# EAGLE board Vorlage ATmega2560-16AU (EAGLE 9.6.2), part 1 of 2
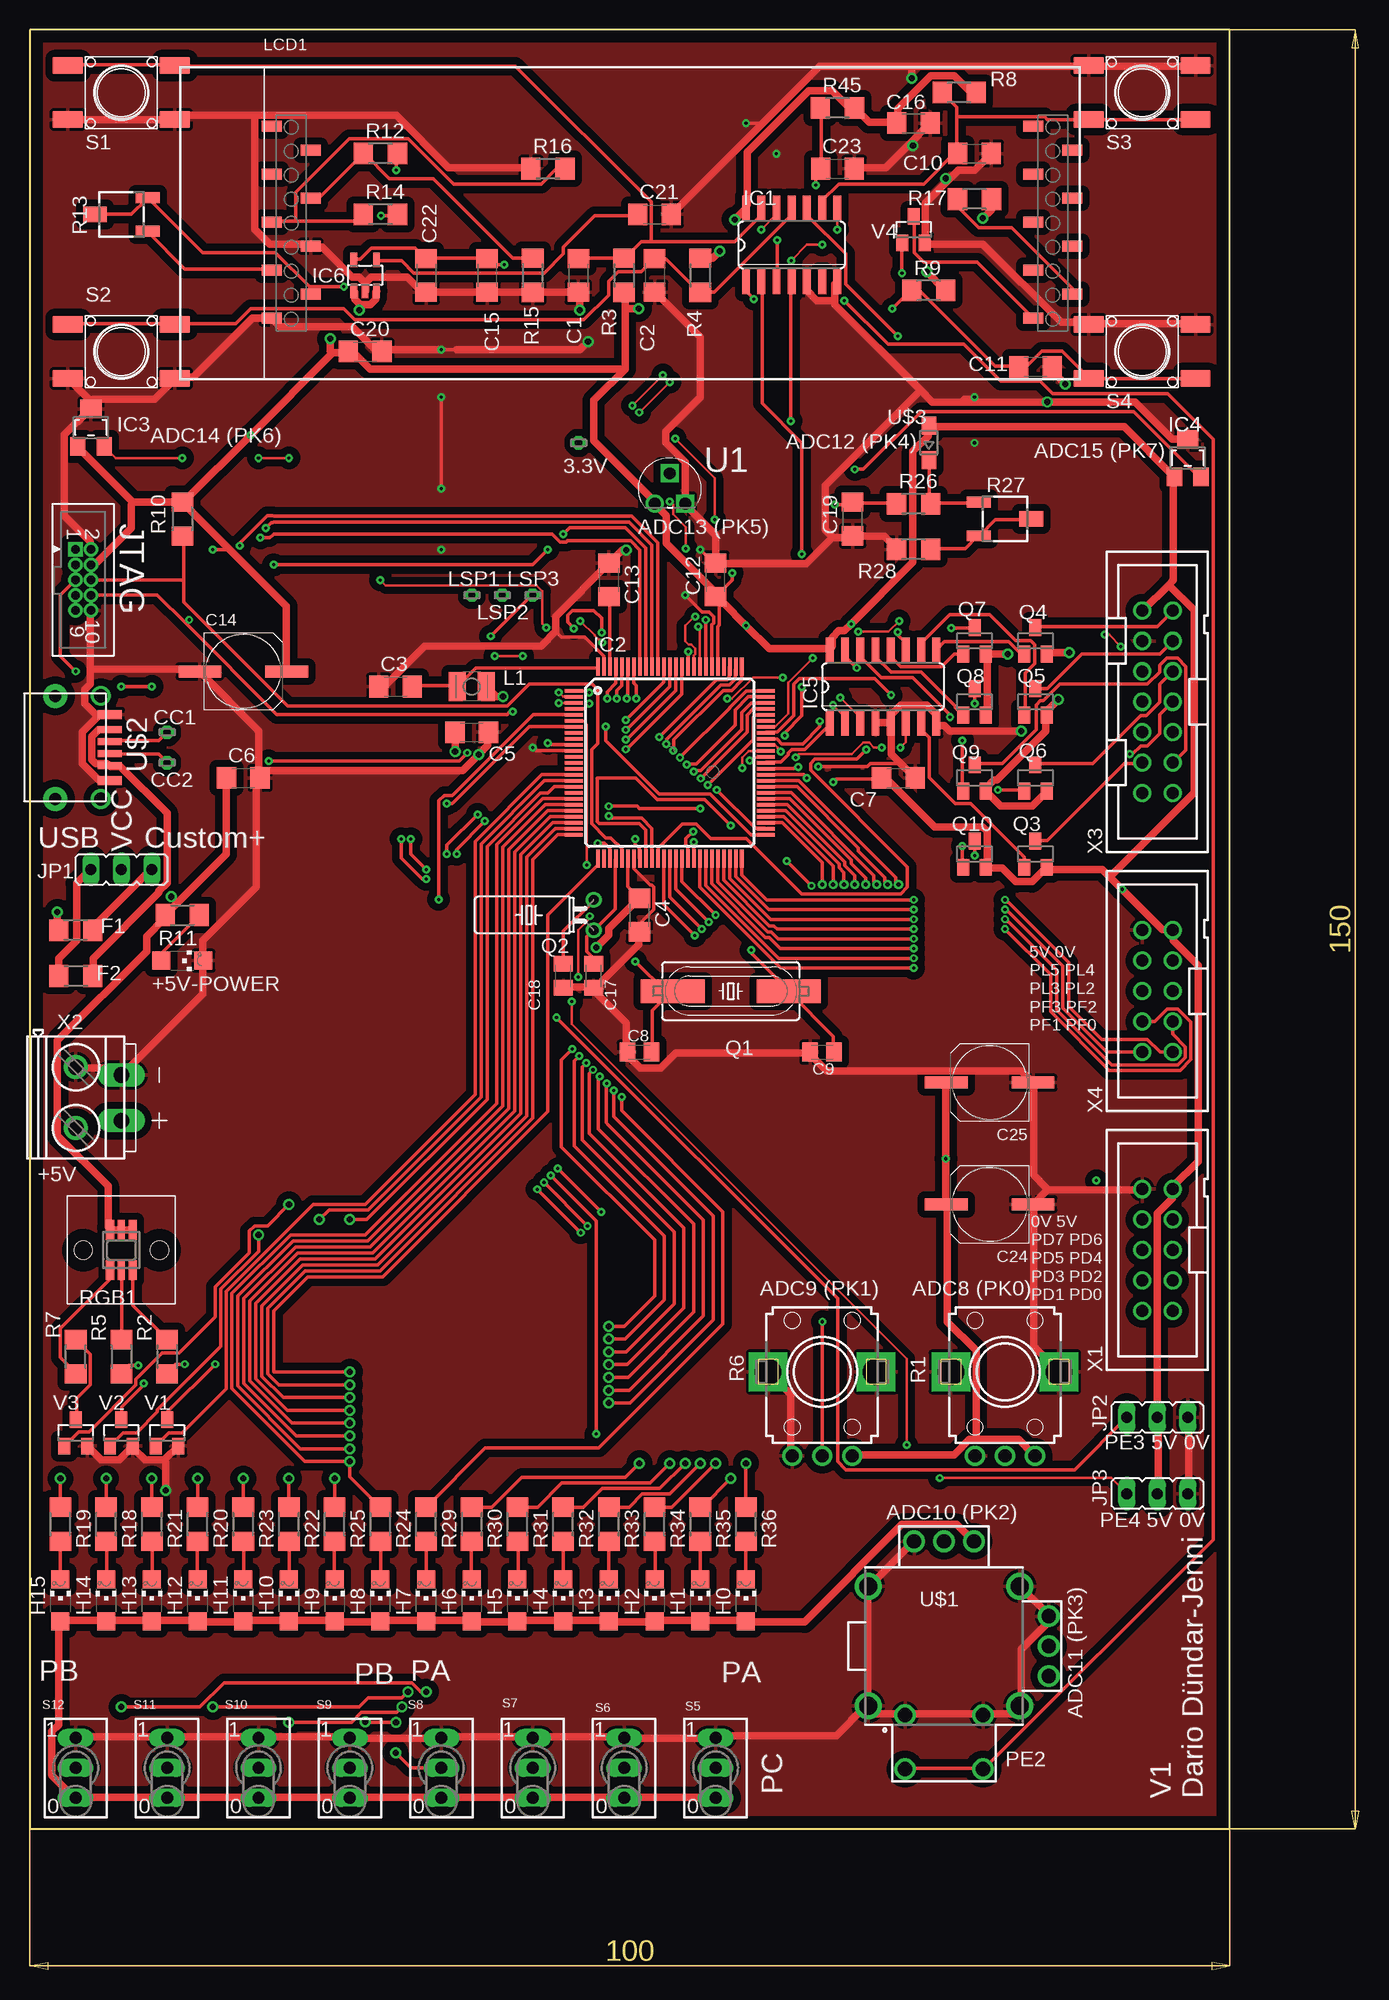
[diagram p1: board, top side]
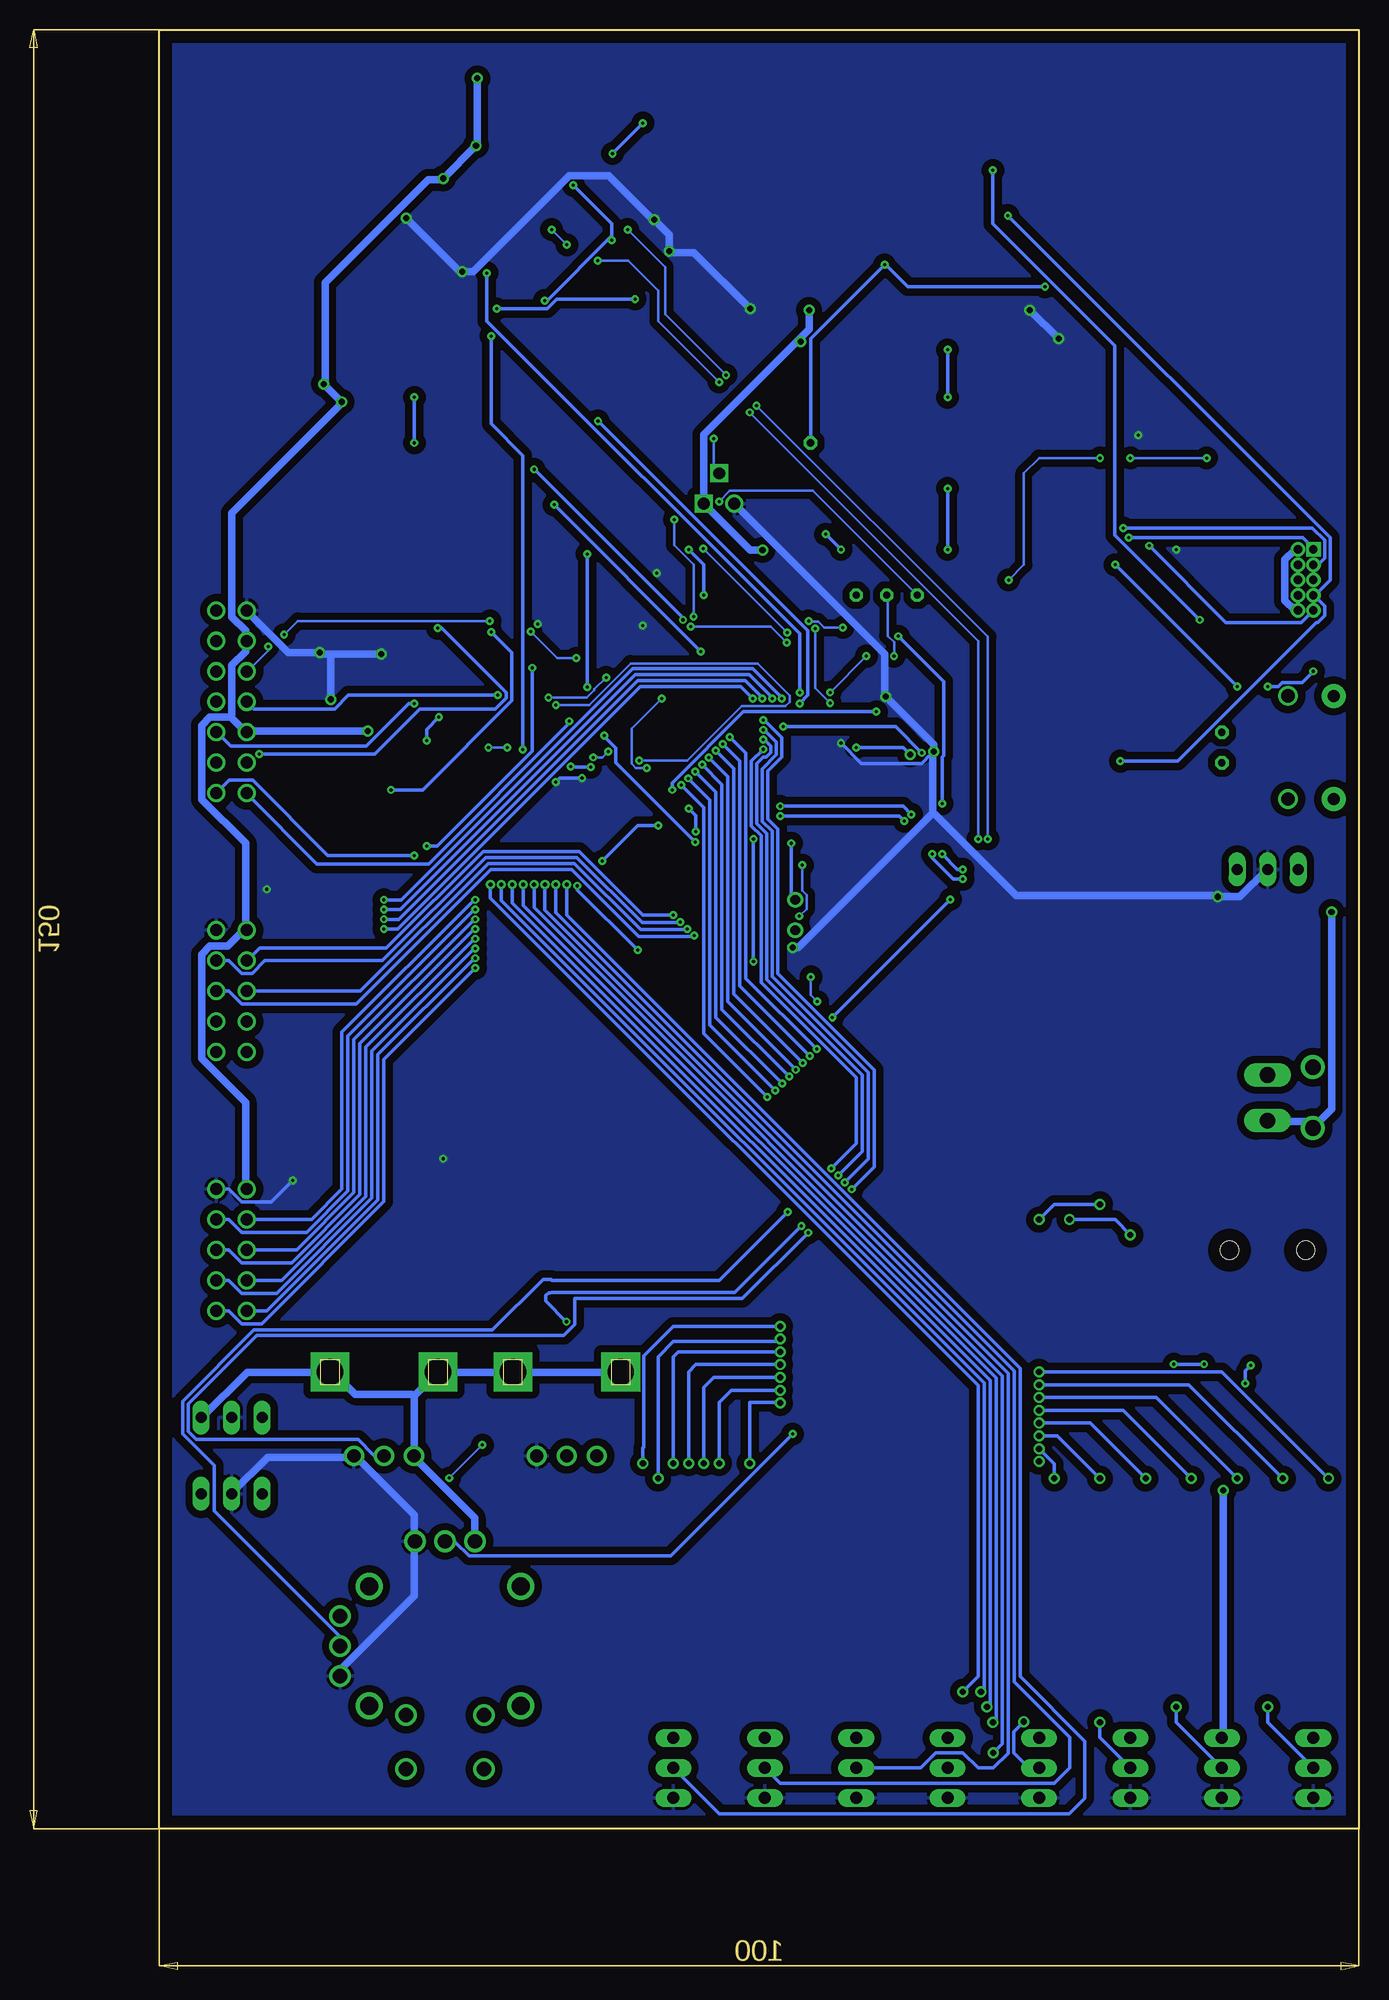
[diagram p2: board, bottom side, seen from below]

Size 100 x 150 mm. Coordinates in mm from the lower left corner, seen from the top.
Outline: 0,0 100,0 100,150 0,150 0,0
Copper layers (1*16): Top 0.035mm / dielectric 1.5mm / Bottom 0.035mm
Design rules "default *": minimum track width 6mil, minimum drill 10mil, track to track 6mil, track to pad 6mil, pad to pad 6mil, via to via 6mil, smd to smd 6mil, copper to edge 40mil, drill to drill 6mil, minimum pad ring 10mil, minimum via ring 8mil, stop-mask expansion 4mil, vias tented up to drill 0mil, thermal gap 10mil
Net classes: 0 default: width 0.203 mm, drill 0.152 mm; 1 POWER: width 0.305 mm, drill 0.254 mm

## Footprints (pad centres in the part's own frame; a part is rotated, then mirrored left to right if it is on the bottom)
LSP11 = drill 0.6 pad 1.016 octagon: MP 0,0
CHIPLED_1206 = smd 1.5 x 1.5: A 0,-1.75; C 0,1.75
C1206 = smd 1.6 x 1.8: 1 -1.4,0; 2 1.4,0
C0805K = smd 1.3 x 1.6: 1 -1,0; 2 1,0
UD-6,3X5,8_NICHICON = smd 3.556 x 1: + 3.62,0; - -3.62,0
F1206 = smd 1.6 x 1.803: 1 -1.422,0; 2 1.422,0
SO14 = smd 0.66 x 2.032: 1 -3.81,-3.073; 2 -2.54,-3.073; 3 -1.27,-3.073; 4 0,-3.073; 5 1.27,-3.073; 6 2.54,-3.073; 7 3.81,-3.073; 8 3.81,3.073; 9 2.54,3.073; 10 1.27,3.073; 11 0,3.073; 12 -1.27,3.073; 13 -2.54,3.073; 14 -3.81,3.073
TQFP100 = smd 1.5 x 0.3: 1 -8,6; 2 -8,5.5; 3 -8,5; 4 -8,4.5; 5 -8,4; 6 -8,3.5; 7 -8,3; 8 -8,2.5; 9 -8,2; 10 -8,1.5; 11 -8,1; 12 -8,0.5; 13 -8,0; 14 -8,-0.5; 15 -8,-1; 16 -8,-1.5; 17 -8,-2; 18 -8,-2.5; 19 -8,-3; 20 -8,-3.5; 21 -8,-4; 22 -8,-4.5; 23 -8,-5; 24 -8,-5.5; 25 -8,-6; 51 8,-6; 52 8,-5.5; 53 8,-5; 54 8,-4.5; 55 8,-4; 56 8,-3.5; 57 8,-3; 58 8,-2.5; 59 8,-2; 60 8,-1.5; 61 8,-1; 62 8,-0.5; 63 8,0; 64 8,0.5; 65 8,1; 66 8,1.5; 67 8,2; 68 8,2.5; 69 8,3; 70 8,3.5; 71 8,4; 72 8,4.5; 73 8,5; 74 8,5.5; 75 8,6 | smd 0.3 x 1.5: 26 -6,-8; 27 -5.5,-8; 28 -5,-8; 29 -4.5,-8; 30 -4,-8; 31 -3.5,-8; 32 -3,-8; 33 -2.5,-8; 34 -2,-8; 35 -1.5,-8; 36 -1,-8; 37 -0.5,-8; 38 0,-8; 39 0.5,-8; 40 1,-8; 41 1.5,-8; 42 2,-8; 43 2.5,-8; 44 3,-8; 45 3.5,-8; 46 4,-8; 47 4.5,-8; 48 5,-8; 49 5.5,-8; 50 6,-8; 76 6,8; 77 5.5,8; 78 5,8; 79 4.5,8; 80 4,8; 81 3.5,8; 82 3,8; 83 2.5,8; 84 2,8; 85 1.5,8; 86 1,8; 87 0.5,8; 88 0,8; 89 -0.5,8; 90 -1,8; 91 -1.5,8; 92 -2,8; 93 -2.5,8; 94 -3,8; 95 -3.5,8; 96 -4,8; 97 -4.5,8; 98 -5,8; 99 -5.5,8; 100 -6,8
SOT23-W = smd 1.27 x 1.524: 1 -1.1,-1.554; 2 1.1,-1.554 | smd 1.778 x 1.524: 3 0,1.554
SO16 = smd 0.66 x 2.032: 1 -4.445,-3.073; 2 -3.175,-3.073; 3 -1.905,-3.073; 4 -0.635,-3.073; 5 0.635,-3.073; 6 1.905,-3.073; 7 3.175,-3.073; 8 4.445,-3.073; 9 4.445,3.073; 10 3.175,3.073; 11 1.905,3.073; 12 0.635,3.073; 13 -0.635,3.073; 14 -1.905,3.073; 15 -3.175,3.073; 16 -4.445,3.073
SOT23-DBV = smd 0.55 x 1.2: 1 -0.95,-1.3; 2 0,-1.3; 3 0.95,-1.3; 4 0.95,1.3; 5 -0.95,1.3
JP2 = drill 0.914 long: 1 -2.54,0; 2 0,0; 3 2.54,0
SAMTEC_FTS-105-01-L-D = drill 0.7 pad 1.067 square: 1 -5.08,-1.27 | drill 0.7 pad 1.067: 2 -5.08,0; 3 -3.81,-1.27; 4 -3.81,0; 5 -2.54,-1.27; 6 -2.54,0; 7 -1.27,-1.27; 8 -1.27,0; 9 0,-1.27; 10 0,0
L2825P = smd 1.4 x 2.4: 1 -1.2,0; 2 1.2,0
EADIP203-4SMD = smd 1.67 x 0.89: 1 -29.38,-9.92; 2 -26.13,-7.92; 3 -29.38,-5.92; 4 -26.13,-3.92; 5 -29.38,-1.92; 6 -26.13,0.08; 7 -29.38,2.08; 8 -26.13,4.08; 9 -29.38,6.08; 10 34.12,6.08; 11 37.37,4.08; 12 34.12,2.08; 13 37.37,0.08; 14 34.12,-1.92; 15 37.37,-3.92; 16 34.12,-5.92; 17 37.37,-7.92; 18 34.12,-9.92
HC49UP = smd 5.334 x 1.93: 1 -4.826,0; 2 4.826,0
TC38H = drill 0.813: 1 -1.27,0; 2 1.27,0
SOT23 = smd 1 x 1.4: 1 -0.95,-1.1; 2 0.95,-1.1; 3 0,1.1
EVUF = drill 1.1 pad 1.676: 1 -2.5,-7; 2 0,-7; 3 2.5,-7 | drill 2.2 square: M1 4.5,0; M2 -4.5,0
R1206 = smd 1.6 x 1.803: 1 -1.422,0; 2 1.422,0
3223G = smd 2 x 0.9: 1 -2.2,1.4; 3 -2.2,-1.4 | smd 2 x 1.3: 2 2.2,0
LED_MIT_DIFUSOR = smd 0.7 x 1.65: 1 -0.95,-1.675; 3 0.95,-1.675; 4 0.95,1.675; 6 -0.95,1.675 | smd 0.6 x 1.65: 2 0,-1.675; 5 0,1.675 | hole 1.5: -3.175,0; 3.175,0
TS42_4PAD = smd 2.54 x 1.4: 1 -4.454,2.25; 2 4.454,2.25; 3 -4.454,-2.25; 4 4.454,-2.25
SPDT_5MM = drill 1 pad 1.422 long: 1 0,-2.5; 2 0,0; 3 0,2.5
TO127P254X495-3P = drill 0.991: 1 -2.54,-2.54 | drill 0.991 square: 2 -1.27,0; 3 0,-2.54
RKJXV1224005 = drill 1.2 pad 1.8: 1 -3.25,-5.75; 2 -3.25,-10.25; 3 3.25,-5.75; 4 3.25,-10.25; 5 8.73,-2.5; 6 8.73,0; 7 8.73,2.5; 8 2.5,8.73; 9 0,8.73; 10 -2.5,8.73 | drill 1.5 pad 2.25: 11 -6.325,5; 12 6.325,5; 15 -6.325,-5; 16 6.325,-5
USB-C = smd 0.762 x 2: 1 -2.75,2.848; 6 2.75,2.848 | smd 0.559 x 2: 2 -1.5,2.848; 3 -0.5,2.848; 4 0.5,2.848; 5 1.5,2.848 | drill 1.1 pad 1.6: P$1 -4.3,2.1; P$2 4.3,2.1 | drill 1 pad 2: P$3 -4.3,-1.7; P$4 4.3,-1.7
SOD232-W = smd 1.5 x 1.2: C 1.45,0; E -1.45,0
PAK100/2500-10 = drill 1 pad 1.422: 1 -5.08,-1.27; 2 -5.08,1.27; 3 -2.54,-1.27; 4 -2.54,1.27; 5 0,-1.27; 6 0,1.27; 7 2.54,-1.27; 8 2.54,1.27; 9 5.08,-1.27; 10 5.08,1.27
MKDSN1,5/2-5,08 = drill 1.3 pad 2: 1.1 -2.561,0.025; 2.1 2.519,0.025 | drill 1.3 long: 1.2 -1.905,3.81; 2.2 1.905,3.81
PAK100/2500-14 = drill 1 pad 1.422: 1 -7.62,-1.27; 2 -7.62,1.27; 3 -5.08,-1.27; 4 -5.08,1.27; 5 -2.54,-1.27; 6 -2.54,1.27; 7 0,-1.27; 8 0,1.27; 9 2.54,-1.27; 10 2.54,1.27; 11 5.08,-1.27; 12 5.08,1.27; 13 7.62,-1.27; 14 7.62,1.27

## Placement (x,y rotation side)
3.3V  3.3V  [LSP11]  45.72,115.57 0 top
+5V-POWER  Gruen  [CHIPLED_1206]  12.7,72.39 270 top
C1  100nF  [C1206]  45.72,129.54 270 top
C2  100nF  [C1206]  52.07,129.54 270 top
C3  100nF  [C1206]  30.48,95.25 0 top
C4  100nF  [C1206]  50.8,76.2 270 top
C5  100nF  [C1206]  36.83,91.44 0 top
C6  100nF  [C1206]  17.78,87.63 0 top
C7  100nF  [C1206]  72.39,87.63 0 top
C8  18pF  [C0805K]  50.8,64.77 0 top
C9  18pF  [C0805K]  66.04,64.77 180 top
C10  100nF  [C1206]  78.74,139.7 0 top
C11  100nF  [C1206]  83.82,121.92 0 top
C12  100nF  [C1206]  57.15,104.14 90 top
C13  100nF  [C1206]  48.26,104.14 270 top
C14  100uF  [UD-6,3X5,8_NICHICON]  17.78,96.52 0 top
C15  100nF  [C1206]  38.1,129.54 270 top
C16  100nF  [C1206]  73.66,142.24 0 top
C17  12pF  [C0805K]  46.99,71.12 270 top
C18  12pF  [C0805K]  44.45,71.12 270 top
C19  1uF  [C1206]  68.58,109.22 90 top
C20  1uF  [C1206]  27.94,123.19 0 top
C21  100nF  [C1206]  52.07,134.62 0 top
C22  1uF  [C1206]  33.02,129.54 270 top
C23  100nF  [C1206]  67.31,138.43 0 top
C24  100uF  [UD-6,3X5,8_NICHICON]  80.01,52.07 180 top
C25  100uF  [UD-6,3X5,8_NICHICON]  80.01,62.23 180 top
CC1  LSP11  [LSP11]  11.43,91.44 0 top
CC2  LSP11  [LSP11]  11.43,88.9 0 top
F1  2A  [F1206]  3.81,74.93 0 top
F2  500mA  [F1206]  3.81,71.12 180 top
H0  blau  [CHIPLED_1206]  59.69,19.05 0 top
H1  blau  [CHIPLED_1206]  55.88,19.05 0 top
H2  blau  [CHIPLED_1206]  52.07,19.05 0 top
H3  blau  [CHIPLED_1206]  48.26,19.05 0 top
H4  blau  [CHIPLED_1206]  44.45,19.05 0 top
H5  blau  [CHIPLED_1206]  40.64,19.05 0 top
H6  blau  [CHIPLED_1206]  36.83,19.05 0 top
H7  blau  [CHIPLED_1206]  33.02,19.05 0 top
H8  blau  [CHIPLED_1206]  29.21,19.05 0 top
H9  blau  [CHIPLED_1206]  25.4,19.05 0 top
H10  blau  [CHIPLED_1206]  21.59,19.05 0 top
H11  blau  [CHIPLED_1206]  17.78,19.05 0 top
H12  blau  [CHIPLED_1206]  13.97,19.05 0 top
H13  blau  [CHIPLED_1206]  10.16,19.05 0 top
H14  blau  [CHIPLED_1206]  6.35,19.05 0 top
H15  blau  [CHIPLED_1206]  2.54,19.05 0 top
IC1  CD74HC14PW  [SO14]  63.5,132.08 0 top
IC2  ATMEGA2560640V-8AU  [TQFP100]  53.34,88.9 0 top
IC3  SS39E  [SOT23-W]  5.08,116.84 0 top
IC4  SS39E  [SOT23-W]  96.52,114.3 0 top
IC5  74AC138D  [SO16]  71.12,95.25 0 top
IC6  XC6210B332MR  [SOT23-DBV]  27.94,129.54 0 top
JP1  Power Select  [JP2]  7.62,80.01 180 top
JP2  SERVO_1  [JP2]  93.98,34.29 0 top
JP3  SERVO_2  [JP2]  93.98,27.94 0 top
JTAG  3220-10-0100-00  [SAMTEC_FTS-105-01-L-D]  5.08,101.6 270 top
L1  10uH  [L2825P]  36.83,95.25 180 top
LCD1  EADIP203-4_SMD  [EADIP203-4SMD]  49.53,135.89 0 top
LSP1  LSP11  [LSP11]  36.83,102.87 0 top
LSP2  LSP11  [LSP11]  39.37,102.87 0 top
LSP3  LSP11  [LSP11]  41.91,102.87 0 top
Q1  16MHz  [HC49UP]  58.42,69.85 180 top
Q2  32.768kHz  [TC38H]  46.99,76.2 90 top
Q3  PMV27UPER  [SOT23]  83.82,81.28 0 top
Q4  PMV27UPER  [SOT23]  83.82,99.06 0 top
Q5  PMV27UPER  [SOT23]  83.82,93.98 0 top
Q6  PMV27UPER  [SOT23]  83.82,87.63 0 top
Q7  PMV27UPER  [SOT23]  78.74,99.06 0 top
Q8  PMV27UPER  [SOT23]  78.74,93.98 0 top
Q9  PMV27UPER  [SOT23]  78.74,87.63 0 top
Q10  PMV27UPER  [SOT23]  78.74,81.28 0 top
R1  10k  [EVUF]  81.28,38.1 0 top
R2  150R  [R1206]  11.43,39.37 90 top
R3  100k  [R1206]  49.53,129.54 90 top
R4  100k  [R1206]  55.88,129.54 270 top
R5  150R  [R1206]  7.62,39.37 90 top
R6  10k  [EVUF]  66.04,38.1 0 top
R7  150R  [R1206]  3.81,39.37 270 top
R8  100k  [R1206]  77.47,144.78 0 top
R9  100k  [R1206]  74.93,128.27 0 top
R10  10k  [R1206]  12.7,109.22 90 top
R11  1k  [R1206]  12.7,76.2 180 top
R12  1k  [R1206]  29.21,139.7 0 top
R13  2k5  [3223G]  7.62,134.62 180 top
R14  1k  [R1206]  29.21,134.62 0 top
R15  2k  [R1206]  41.91,129.54 90 top
R16  2k  [R1206]  43.18,138.43 0 top
R17  150R  [R1206]  78.74,135.89 0 top
R18  150R  [R1206]  6.35,25.4 270 top
R19  150R  [R1206]  2.54,25.4 270 top
R20  150R  [R1206]  13.97,25.4 270 top
R21  150R  [R1206]  10.16,25.4 270 top
R22  150R  [R1206]  21.59,25.4 270 top
R23  150R  [R1206]  17.78,25.4 270 top
R24  150R  [R1206]  29.21,25.4 270 top
R25  150R  [R1206]  25.4,25.4 270 top
R26  100k  [R1206]  73.66,110.49 0 top
R27  50k  [3223G]  81.28,109.22 0 top
R28  10k  [R1206]  73.66,106.68 0 top
R29  150R  [R1206]  33.02,25.4 270 top
R30  150R  [R1206]  36.83,25.4 270 top
R31  150R  [R1206]  40.64,25.4 270 top
R32  150R  [R1206]  44.45,25.4 270 top
R33  150R  [R1206]  48.26,25.4 270 top
R34  150R  [R1206]  52.07,25.4 270 top
R35  150R  [R1206]  55.88,25.4 270 top
R36  150R  [R1206]  59.69,25.4 270 top
R45  100k  [R1206]  67.31,143.51 0 top
RGB1  LED  [LED_MIT_DIFUSOR]  7.62,48.26 0 top
S1  [TS42_4PAD]  7.62,144.78 0 top
S2  [TS42_4PAD]  7.62,123.19 0 top
S3  [TS42_4PAD]  92.71,144.78 0 top
S4  [TS42_4PAD]  92.71,123.19 0 top
S5  TL36POSPDT_5MM  [SPDT_5MM]  57.15,5.08 0 top
S6  TL36POSPDT_5MM  [SPDT_5MM]  49.53,5.08 0 top
S7  TL36POSPDT_5MM  [SPDT_5MM]  41.91,5.08 0 top
S8  TL36POSPDT_5MM  [SPDT_5MM]  34.29,5.08 0 top
S9  TL36POSPDT_5MM  [SPDT_5MM]  26.67,5.08 0 top
S10  TL36POSPDT_5MM  [SPDT_5MM]  19.05,5.08 0 top
S11  TL36POSPDT_5MM  [SPDT_5MM]  11.43,5.08 0 top
S12  TL36POSPDT_5MM  [SPDT_5MM]  3.81,5.08 0 top
U1  LM35DZ  [TO127P254X495-3P]  54.61,113.03 0 top
U$1  JOYSTICK  [RKJXV1224005]  76.2,15.24 0 top
U$2  USB-C_POWER  [USB-C]  3.81,90.17 270 top
U$3  ALS-PT17  [SOD232-W]  74.93,115.57 90 top
V1  PMV20EN  [SOT23]  11.43,33.02 0 top
V2  PMV20EN  [SOT23]  7.62,33.02 0 top
V3  PMV20EN  [SOT23]  3.81,33.02 0 top
V4  PMV20EN  [SOT23]  73.66,133.35 0 top
X1  2510-  [PAK100/2500-10]  93.98,48.26 90 top
X2  +5V  [MKDSN1,5/2-5,08]  3.81,60.96 270 top
X3  2514-  [PAK100/2500-14]  93.98,93.98 90 top
X4  2510-  [PAK100/2500-10]  93.98,69.85 90 top